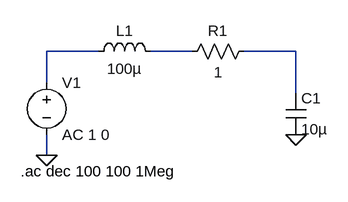
[diagram p0: schematic Draft4.asc]
Draft4.asc, the LTspice schematic file:
Version 4
SHEET 1 880 680
WIRE 208 64 128 64
WIRE 352 64 288 64
WIRE 512 64 432 64
WIRE 128 112 128 64
WIRE 512 128 512 64
WIRE 128 224 128 192
FLAG 128 224 0
FLAG 512 192 0
SYMBOL voltage 128 96 R0
SYMATTR InstName V1
SYMATTR Value AC 1 0
SYMBOL ind 192 80 R270
WINDOW 0 32 56 VTop 2
WINDOW 3 5 56 VBottom 2
SYMATTR InstName L1
SYMATTR Value 100µ
SYMBOL res 448 48 R90
WINDOW 0 0 56 VBottom 2
WINDOW 3 32 56 VTop 2
SYMATTR InstName R1
SYMATTR Value 1
SYMBOL cap 496 128 R0
SYMATTR InstName C1
SYMATTR Value 10µ
TEXT 88 248 Left 2 !.ac dec 100 100 1Meg

The netlist it stands for:
* Draft4.asc
V1 N001 0 AC 1 0
L1 N001 N002 100µ
R1 N003 N002 1
C1 N003 0 10µ
.ac dec 100 100 1Meg
.backanno
.end